# Altium project SCM.PrjPcb (part 1 of 2)
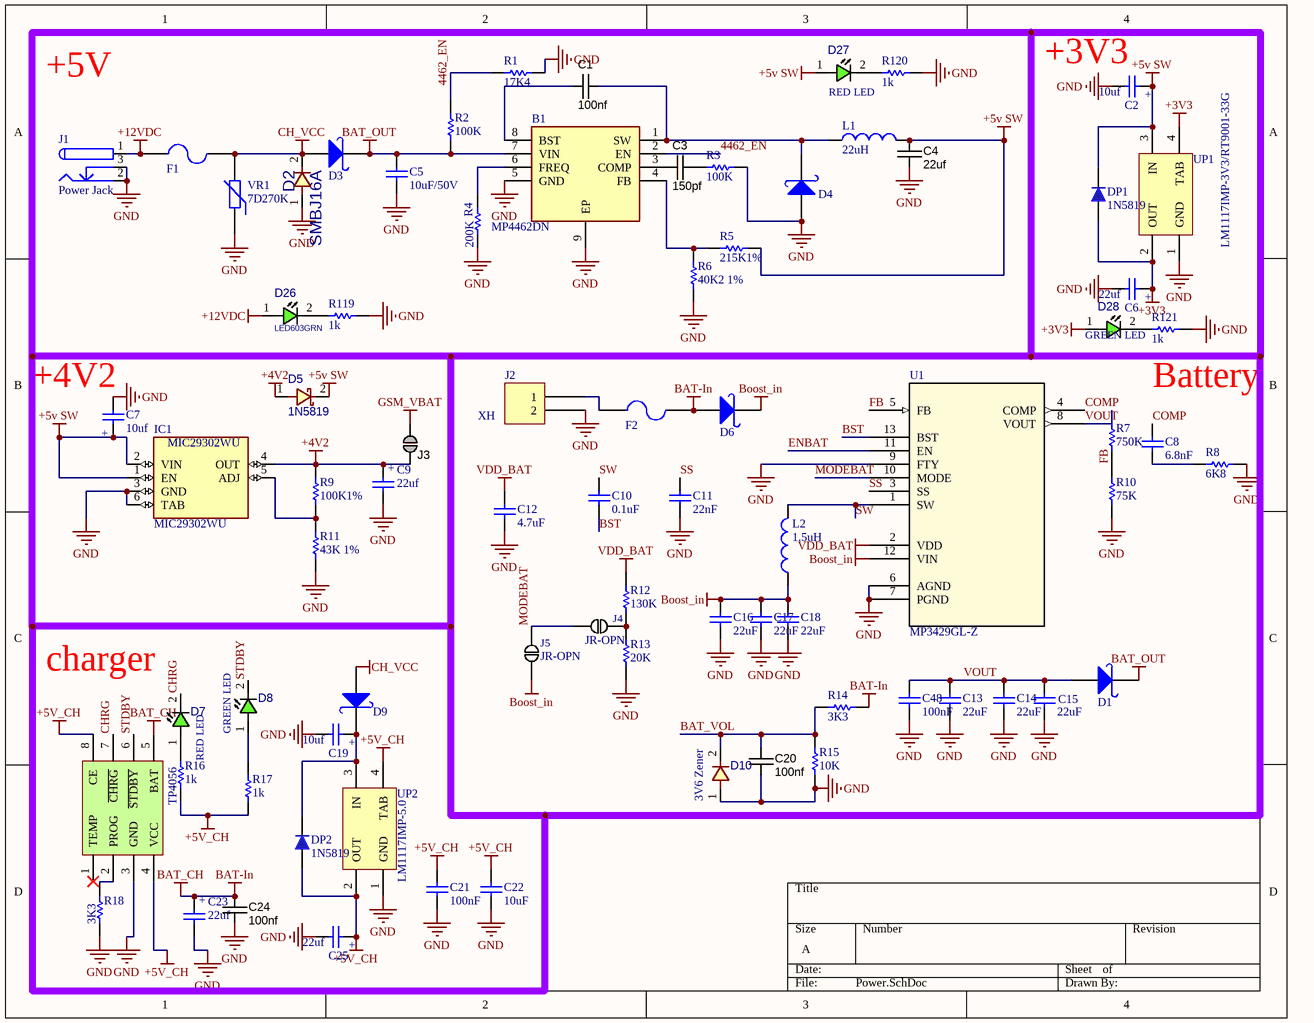
[diagram p0: Power.SchDoc]
10 sheets, 375 parts. Net scope: global (net labels, ports and power ports of the same name join across sheets).
Board files: PCB1.PcbDoc, POLY KEEP OUT.PcbDoc
Sheets:
  Power.SchDoc
  MCU.SchDoc
  UI.SchDoc
  GSM.SchDoc
  RF & wireless.SchDoc
  LAN.SchDoc
  sensors.SchDoc
  Outputs.SchDoc
  Power2.SchDoc
  memory.SchDoc

## Sheet Power.SchDoc
size A; SheetNumber: 1; SheetTotal: 10

### Parts
B1  MP4462DN  [SOIC127P600X170-9N]
C1  100nf  [CAPC1608X90N]
C2  10uf  [MY_CAP_SMD-A]
C3  150pf  [CAPC1608X90N]
C4  22uf  [CAPC1608X90N]
C5  10uF/50V
C6  22uf  [MY_CAP_SMD-A]
C7  10uf  [MY_CAP_SMD-A]
C8  6.8nF  [CAPC3413X12N]
C9  22uf  [MY_CAP_SMD-A]
C10  0.1uF  [CAPC3413X12N]
C11  22nF  [CAPC3413X12N]
C12  4.7uF  [CAPC3413X12N]
C13  22uF  [CAPC3413X12N]
C14  22uF  [CAPC3413X12N]
C15  22uF  [CAPC3413X12N]
C16  22uF  [CAPC3413X12N]
C17  22uF  [CAPC3413X12N]
C18  22uF  [CAPC3413X12N]
C19  10uf  [MY_CAP_SMD-A]
C20  100nf  [CAPC1608X90N]
C21  100nF  [CAPC3413X12N]
C22  10uF  [CAPC3413X12N]
C23  22uf  [MY_CAP_SMD-A]
C24  100nf  [CAPC1608X90N]
C25  22uf  [MY_CAP_SMD-A]
C48  100nF  [CAPC3413X12N]
D1  1n5822  [DO-214AB(SMC)]  (value not drawn)
D2  value SMBJ16A  [DO214AA SMB]  (hidden comment: SMBJ16A-TR)
D3  1n5822  [DO-214AB(SMC)]  (value not drawn)
D4  1n5822  [DO-214AB(SMC)]  (value not drawn)
D5  1N5819  [D_SOD123W]
D6  1n5822  [DO-214AB(SMC)]  (value not drawn)
D7  RED LED  [LED0603GRN]
D8  GREEN LED  [LED0603GRN]
D9  1n5822  [DO-214AB(SMC)]  (value not drawn)
D10  value 3V6 Zener  [D_SOD80]  (hidden comment: 5Z1)
D26  LED603GRN  [LED0603GRN]
D27  RED LED  [LED0603GRN]
D28  GREEN LED  [LED0603GRN]
DP1  1N5819  [430X270D]
DP2  1N5819  [430X270D]
F1  FUSE Socket  [Crystal SMD]  (value not drawn)
F2  FUSE Socket  (value not drawn)
IC1  MIC29302WU  [TO263-5]
J1  Power Jack  [Power Jack]
J2  XH  [JST XH B2B-XH-A]
J3  Jumper  [JUMP1]  (value not drawn)  (no BOM)
J4  JR-OPN
J5  JR-OPN
L1  22uH  [INDUCTOR_SMD_3A]
L2  1.5uH  [INDUCTOR_SMD_3A]
R1  17K4  [Resistor_SMD_0603 (1608)]
R2  100K  [Resistor_SMD_0603 (1608)]
R3  100K  [Resistor_SMD_0603 (1608)]
R4  200K  [Resistor_SMD_0603 (1608)]
R5  215K1%  [Resistor_SMD_0603 (1608)]
R6  40K2 1%  [Resistor_SMD_0603 (1608)]
R7  750K  [Resistor_SMD_0603 (1608)]
R8  6K8  [Resistor_SMD_0603 (1608)]
R9  100K1%  [Resistor_SMD_0603 (1608)]
R10  75K  [Resistor_SMD_0603 (1608)]
R11  43K 1%  [Resistor_SMD_0603 (1608)]
R12  130K  [Resistor_SMD_0603 (1608)]
R13  20K  [Resistor_SMD_0603 (1608)]
R14  3K3  [Resistor_SMD_0603 (1608)]
R15  10K  [Resistor_SMD_0603 (1608)]
R16  1k  [Resistor_SMD_0603 (1608)]
R17  1k  [Resistor_SMD_0603 (1608)]
R18  3K3  [Resistor_SMD_0603 (1608)]
R119  1k  [Resistor_SMD_0603 (1608)]
R120  1k  [Resistor_SMD_0603 (1608)]
R121  1k  [Resistor_SMD_0603 (1608)]
TP4056  TP4056  [TP4056]  (value not drawn)
U1  MP3429GL-Z  [QFN-3x4_MP3429_MNP]
UP1  LM1117IMP-3V3/RT9001-33G  [SOT223_M]
UP2  LM1117IMP-5.0  [SOT223_M]
VR1  7D270K  [05D XXX]

### Nets
+3V3: C6.+ D28.1(ANODE) DP1.1 UP1.2(OUT) UP1.4(TAB)
+4V2: C9.+ D5.1 IC1.4(OUT) J3.2 R9.2
+5v SW: C2.+ C4.2 C7.+ D5.2 D27.1(ANODE) DP1.2 IC1.1(EN) IC1.2(VIN) L1.2 R5.1 UP1.3(IN)
+5V_CH: C21.2 C22.2 C25.+ DP2.1 R16.1 R17.1 TP4056.4(VCC) TP4056.8(CE) UP2.2(OUT) UP2.4(TAB)
+12VDC: D26.1(ANODE) F1.1 J1.1
BAT-In: C23.+ C24.1 D6.1(A) F2.2 R14.2 TP4056.5(BAT)  [also labelled BAT_CH]
BAT_OUT: B1.7(VIN) C5.2 D1.2(K) D3.2(K) R2.1
Boost_in: C16.2 C17.2 C18.2 D6.2(K) J5.2 L2.1 U1.12(VIN)
CH_VCC: D2.2 D3.1(A) D9.1(A) F1.2 VR1.2
GND: B1.5(GND) B1.9(EP) C2.- C4.1 C5.1 C6.- C7.- C9.- C11.1 C12.1 C13.1 C14.1 C15.1 C16.1 C17.1 C18.1 C19.- C20.2 C21.1 C22.1 C23.- C24.2 C25.- C48.1 D2.1 D4.1(A) D10.1 IC1.3(GND) IC1.6(TAB) J1.2 J1.3 J2.2 R1.2 R3.1 R4.2 R6.1 R8.1 R10.1 R11.1 R13.1 R15.1 R18.1 R119.2 R120.2 R121.2 TP4056.3(GND) U1.6(AGND) U1.7(PGND) U1.9(FTY) UP1.1(GND) UP2.1(GND) VR1.1
GSM_VBAT: J3.1
VDD_BAT: C12.2 R12.2 U1.2(VDD)
4462_EN: B1.2(EN) R1.1 R2.2
BAT_VOL: C20.1 D10.2 R14.1 R15.2
BST: C10.1 U1.13(BST)
CHRG: D7.2(CATHODE) TP4056.7(~{CHRG})
COMP: C8.2 U1.4(COMP)
ENBAT: U1.11(EN)
FB: R7.1 R10.2 U1.5(FB)
MODEBAT: J4.2 J5.1 U1.10(MODE)
SS: C11.2 U1.3(SS)
STDBY: D8.2(CATHODE) TP4056.6(~{STDBY})
SW: C10.2 L2.2 U1.1(SW)
VOUT: C13.2 C14.2 C15.2 C48.2 D1.1(A) R7.2 U1.8(VOUT)
NetB1_1: B1.1(SW) C1.2 D4.2(K) L1.1
NetB1_3: B1.3(COMP) C3.1
NetB1_4: B1.4(FB) R5.2 R6.2
NetB1_6: B1.6(FREQ) R4.1
NetB1_8: B1.8(BST) C1.1
NetC3_2: C3.2 R3.2
NetC8_1: C8.1 R8.2
NetC19_+: C19.+ D9.2(K) DP2.2 UP2.3(IN)
NetD7_1: D7.1(ANODE) R16.2
NetD8_1: D8.1(ANODE) R17.2
NetD26_2: D26.2(CATHODE) R119.1
NetD27_2: D27.2(CATHODE) R120.1
NetD28_2: D28.2(CATHODE) R121.1
NetF2_1: F2.1 J2.1
NetIC1_5: IC1.5(ADJ) R9.1 R11.2
NetJ4_1: J4.1 R12.1 R13.2
NetR18_2: R18.2 TP4056.2(PROG)

Not connected (* = marked no-connect by the designer): TP4056 1(TEMP)*

### Notes on the sheet
- +5V
- (near C2) +3V3
- (near C7) +4V2
- Battery
- (near D7) charger

### Library data of the parts
B1 = MP4462DN-Z-LF: Power Supply; Manufacturer_Name: Monolithic Power Systems (MPS); Geometry.Height: 1.7mm; Manufacturer_Part_Number: MP4462DN-Z-LF; Mouser Part Number: *; Mouser Price/Stock: *; Arrow Part Number: *; Arrow Price/Stock: *; Datasheet Link: https://datasheet.octopart.com/MP4462DN-LF-Z-Monolithic-Power-Systems-datasheet-26450847.pdf
C1 C3 = CAPC_100n_0603_X7R_50V_10%: Capacitor C SMD 0603; Manufacturer 1: AVX Corporation; Manufacturer Part Number 1: 06035C104KAT2A; Tolerance: ±10%; Ratings: 50V; X7R; Material: ceramic; SCDType: spec; Value: 100n; Manufacturer 2: TDK Corporation; Manufacturer Part Number 2: C1608X7R1H104K; Package / Case: 0603 (1608 Metric); Supplier 1: Digi-Key; Supplier Part Number 1: 478-5052-1-ND; ComponentLink1URL: http://www.avx.com/docs/Catalogs/cx7r.pdf; ComponentLink1Description: http://www.avx.com/docs/Catalogs/cx7r.pdf; Supplier 2: Digi-Key; Supplier Part Number 2: 445-1314-1-ND; ComponentLink2URL: http://product.tdk.com/capacitor/mlcc/en/documents/mlcc_commercial_general_en.pdf; ComponentLink2Description: http://product.tdk.com/capacitor/mlcc/en/documents/mlcc_commercial_general_en.pdf
C2 C6 C7 C9 C23 = CAP_TANTAL_A: Capacitor Tantalum SMD; Value: 3300u
C4 = CAPC_100n_0603_X7R_50V_10%: Capacitor C SMD 1206; Manufacturer 1: AVX Corporation; Manufacturer Part Number 1: 06035C104KAT2A; Tolerance: ±10%; Ratings: 50V; X7R; Material: ceramic; SCDType: spec; Value: 100n; Manufacturer 2: TDK Corporation; Manufacturer Part Number 2: C1608X7R1H104K; Package / Case: 0603 (1608 Metric); Supplier 1: Digi-Key; Supplier Part Number 1: 478-5052-1-ND; ComponentLink1URL: http://www.avx.com/docs/Catalogs/cx7r.pdf; ComponentLink1Description: http://www.avx.com/docs/Catalogs/cx7r.pdf; Supplier 2: Digi-Key; Supplier Part Number 2: 445-1314-1-ND; ComponentLink2URL: http://product.tdk.com/capacitor/mlcc/en/documents/mlcc_commercial_general_en.pdf; ComponentLink2Description: http://product.tdk.com/capacitor/mlcc/en/documents/mlcc_commercial_general_en.pdf
C5 = CAP SMD 0805: Capacitor C SMD 1206
C8 = CAP SMD 0805: Capacitor C SMD 0603; Designer: Abbas Basereh; Desc.: CAP SMD 0805; Data: 16-12-2016
C10-C15 C18 C21 C22 C48 = CAP SMD 0805: CAP 0805; Designer: Abbas Basereh; Desc.: CAP SMD 0805; Data: 16-12-2016
C16 C17 = CAP SMD 0805: Capacitor C SMD 0805; Designer: Abbas Basereh; Desc.: CAP SMD 0805; Data: 16-12-2016
C19 C25 = CAP_TANTAL_A: 3.2X1.6MM; Value: 3300u
C20 C24 = CAPC_100n_0603_X7R_50V_10%: Capacitor SMD Cer 100nF 10% 50V X7R 0603; Manufacturer 1: AVX Corporation; Manufacturer Part Number 1: 06035C104KAT2A; Ratings: 50V; X7R; Material: ceramic; SCDType: spec; Value: 100n; Manufacturer 2: TDK Corporation; Manufacturer Part Number 2: C1608X7R1H104K; Package / Case: 0603 (1608 Metric); Tolerance: ±10%; Supplier 1: Digi-Key; Supplier Part Number 1: 478-5052-1-ND; ComponentLink1URL: http://www.avx.com/docs/Catalogs/cx7r.pdf; ComponentLink1Description: http://www.avx.com/docs/Catalogs/cx7r.pdf; Supplier 2: Digi-Key; Supplier Part Number 2: 445-1314-1-ND; ComponentLink2URL: http://product.tdk.com/capacitor/mlcc/en/documents/mlcc_commercial_general_en.pdf; ComponentLink2Description: http://product.tdk.com/capacitor/mlcc/en/documents/mlcc_commercial_general_en.pdf
D1 D3 D4 D6 D9 = 1n5822 SMD: Schottky Rectifiers; Part. No: SS34; Manufacturer: ON Semiconductor/Fairchild; Designer: Abbas Basereh; Link: https://www.aliexpress.com/item/Free-shipping-100pcs-1n5822-sma-smd-do-214ac-Schottky-diode-ss34/32337482329.html?spm=2114.01010208.3.1.zLZDsP&ws_ab_test=searchweb0_0,searchweb201602_4_10065_10068_10084_10083_10080_10082_10081_10060_10061_10062_10056_10055_10054_10059_10099_10078_10079_427_10073_10103_10102_10096_10052_10050_10051,searchweb201603_4&btsid=6e50dc92-ac69-45bc-a19e-209af19ce602; Link: http://www.tme.eu/en/details/ss34/smd-schottky-diodes/vishay/ss34-e357t/; Link: http://www.digikey.com/product-detail/en/on-semiconductor-fairchild/SS34/SS34FSCT-ND/2094459; Data: 16-12-2016
D2 = SMBJ12A-TR: TVS Surface Mount Transient Voltage Suppressors Diode
D5 = DIODE_SMD_SCHOTTKY_1N5819: DIODE, GENERAL PURPOSE, 1000V/1A; MANF: DIODES; MANF_P#: 1N5819HW-7-F; DESC: DESCRIPTION; PARAM2: 1A; PARAM: 40V; ASSEMBLY: ASSEMBLY; PRICE: PRICE; VALUE: 1N5819
D7 D8 D27 D28 = LED_SMD_0603_GRN: LED, SMD, 0603, GREEN; PARAM: 20mA; MANF: Kingbright; DESC: DESCRIPTION; MANF_P#: APT1608SGC; PARAM2: 2.2V; VALUE: LED603GRN; ASSEMBLY: ASSEMBLY; PRICE: 1: 0.14$, 100: 6.8$
D10 = 1N4148 SMD: DIODE, FAST SWTICHING, 0.3A, 0.5W
D26 = LED_SMD_0603_GRN: LED, SMD, 0603, GREEN; PARAM: 20mA; MANF: Kingbright; DESC: DESCRIPTION; MANF_P#: APT1608SGC; PARAM2: 2.2V; ASSEMBLY: ASSEMBLY; PRICE: 1: 0.14$, 100: 6.8$; VALUE: LED603GRN
DP1 = 1N5819: DIODE, GENERAL PURPOSE, 1000V/1A; Designer: Abbas Basereh; Data: 16-12-2016; Link: *; Part. No: *
DP2 = 1N5819: Schottkey Rectifiers; Designer: Abbas Basereh; Data: 16-12-2016; Link: *; Part. No: *
F1 F2 = Fuse SMD1206: SMD Fuses 1808; Designer: Abbas Basereh; Desc.: SMD Fuses 1206; Data: 16-12-2016
IC1 = MIC29302WU: Linear Voltage Regulator IC 1 Output 3A TO-263-5; MF: {'manufacturer': u'Microchip Technology'}; Package: None; Price: None; Value: *; MP: MIC29302WU; Availability: Unavailable
J2 = B2B-XH-A(LF)(SN): CONN HEADER VERT 2POS 2.5MM XH; Manufacturer: JST Sales America Inc.; Contact Length - Post: 0.134" (3.40mm); Current Rating (Amps): 3A; Material Flammability Rating: UL94 V-0; Number of Positions: 2; Number of Positions Loaded: All; Pitch - Mating: 0.098" (2.50mm); Shrouding: Shrouded - 4 Wall; Style: Board to Cable/Wire; Voltage Rating: 250V; Part Number: B2B-XH-A(LF)(SN); ComponentLink1Description: Datasheet; ComponentLink1URL: http://www.jst-mfg.com/product/pdf/eng/eXH.pdf; ComponentLink2Description: DigiKey Link; ComponentLink2URL: http://digikey.com/product-detail/en/jst-sales-america-inc/B2B-XH-A-LF-SN/455-2247-ND/1651045; Connector Type: Header; Contact Finish - Mating: Tin; Contact Finish - Post: Tin; Contact Material: Brass; Contact Shape: Square; Contact Type: Male Pin; Fastening Type: Detent Lock; Insulation Color: Natural; Insulation Height: 0.276" (7.00mm); Insulation Material: Polyamide (PA66), Nylon 6/6; LastUpdated: 1/12/2020 11:46:08 PM; Lifecycle Status: Active; Minimum Order: 1; Mounting Type: Through Hole; Number of Rows: 1; Operating Temperature: -25°C ~ 85°C; Packaging: Bulk; PartId: 67; Part Status: Active; Price: 0.15; Series: XH; Supplier 1: DigiKey; Supplier Part Number 1: 455-2247-ND; Termination: Press-Fit, Solder
J3 = JUMP1: SMD jumper
J4 J5 = BYPASS: SOLDERDOT BYPASS; Manufacturer Part Number 1: Board Feature; Reel: Open; Supplier 1: Solder-it-yourself; Manufacturer 1: Board feature
L1 L2 = INDUCTOR_SMD_3A
R1 R5 = Resistor: Resistor SMD 0805; Email: razi.vesali@gmail.com; Value: 10k; Published: 17-Jun-2016; LatestRevisionNote: Re-released for puplic; Publisher: Seyed Razi Vesali
R2-R4 R6 = Resistor: Resistor SMD 0603; Email: razi.vesali@gmail.com; Value: 10k; Published: 17-Jun-2016; LatestRevisionNote: Re-released for puplic; Publisher: Seyed Razi Vesali
R7-R11 R13 R14 R17 R18 R120 R121 = Resistor: Resistor 0603; Email: razi.vesali@gmail.com; Value: 10k; Published: 17-Jun-2016; LatestRevisionNote: Re-released for puplic; Publisher: Seyed Razi Vesali
R12 R16 = Resistor: Resistor0603; Email: razi.vesali@gmail.com; Value: 10k; Published: 17-Jun-2016; LatestRevisionNote: Re-released for puplic; Publisher: Seyed Razi Vesali
R15 = Resistor: Resistor 0603; Email: razi.vesali@gmail.com; Published: 17-Jun-2016; LatestRevisionNote: Re-released for puplic; Publisher: Seyed Razi Vesali; Value: 10k
R119 = Resistor: Email: razi.vesali@gmail.com; Value: 10k; Published: 17-Jun-2016; LatestRevisionNote: Re-released for puplic; Publisher: Seyed Razi Vesali
U1 = MP3429GL-Z: No Description Available; Mfr_Name: Monolithic Power Systems; Copyright: Copyright (C) 2022 Ultra Librarian. All rights reserved.; Manufacturer_Part_Number: MP3429GL-Z; RefDes: RefDes; Type: DEV
UP1 UP2 = AMS1117-x.x: x.x Volt, 800mA Low-Dropout Linear Regulator, 4-pin SOT-223; Designer: Ali Hafizi; Data: 16-12-2016
VR1 = VARISTOR (VDR): VARISTORS; Manufacturer: china-canada-philipina; Designer: Abbas Basereh; VALUE: xxDxxx; Models: MOV-VDR-COV; Data: 2017-1-5; Link: digikey.com; PUBLISHER: ABBAS BASEREH

## Sheet MCU.SchDoc
size A; SheetNumber: 2; SheetTotal: 10
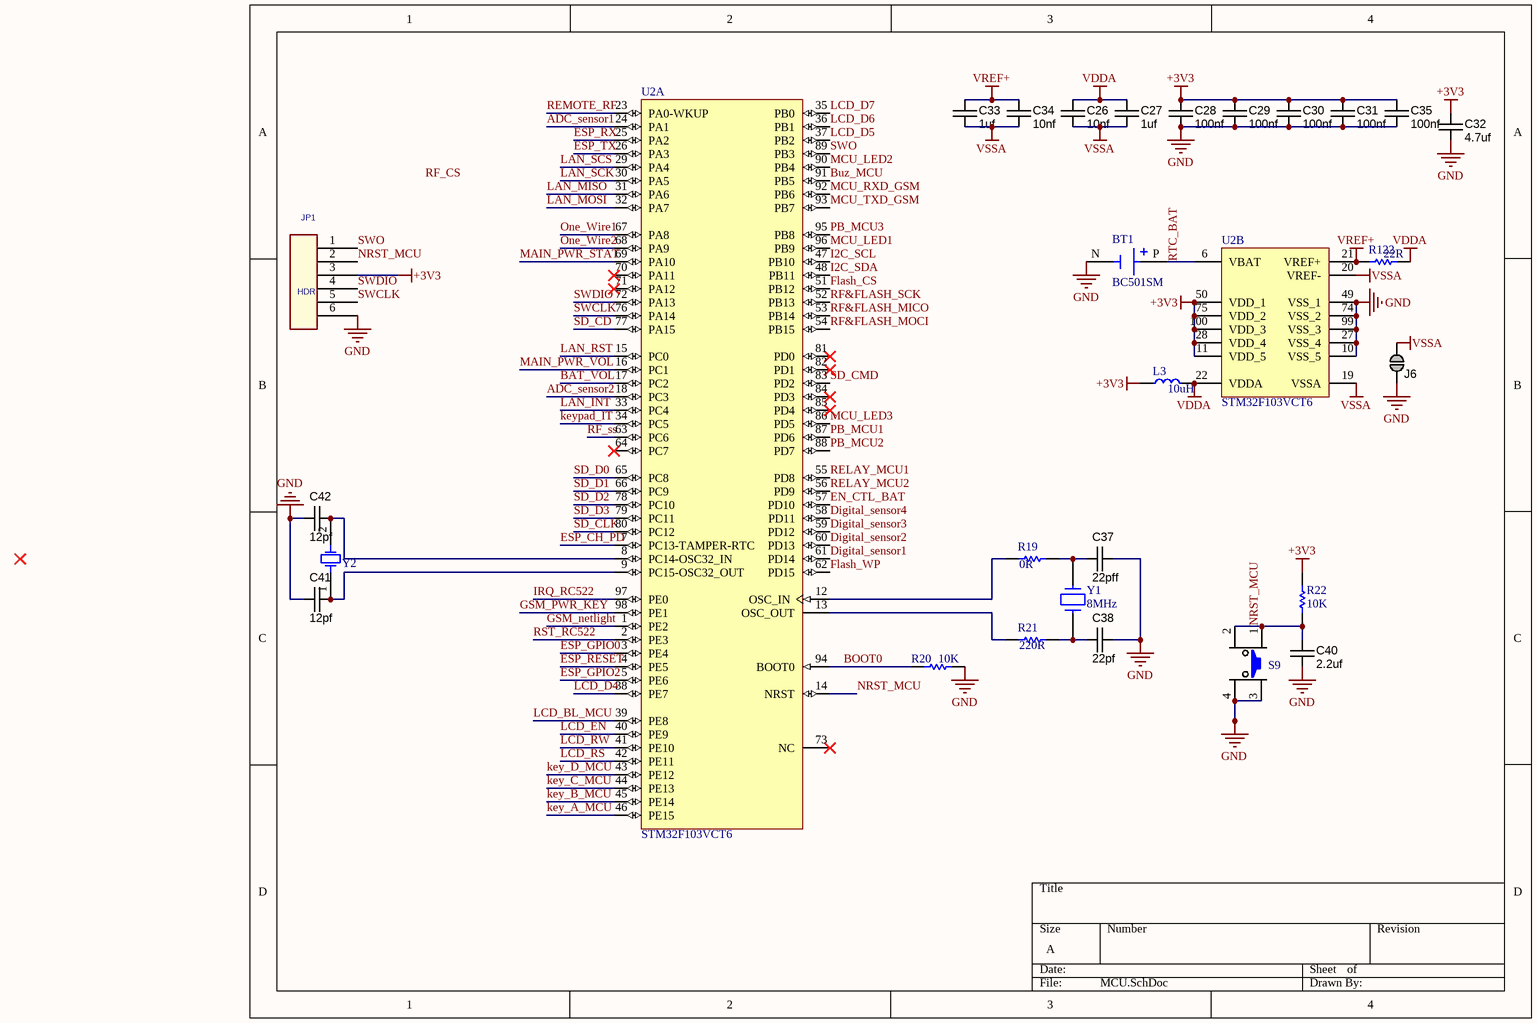
[diagram p1: MCU.SchDoc]

### Parts
BT1  BC501SM  [BAT_BC501SM]
C26  10nf  [CAPC1608X90N]
C27  1uf  [CAPC1608X90N]
C28  100nf  [CAPC1608X90N]
C29  100nf  [CAPC1608X90N]
C30  100nf  [CAPC1608X90N]
C31  100nf  [CAPC1608X90N]
C32  4.7uf  [CAPC1608X90N]
C33  1uf  [CAPC1608X90N]
C34  10nf  [CAPC1608X90N]
C35  100nf  [CAPC1608X90N]
C37  22pff  [CAPC1608X90N]
C38  22pf  [CAPC1608X90N]
C40  2.2uf  [CAPC1608X90N]
C41  12pf  [CAPC1608X90N]
C42  12pf  [CAPC1608X90N]
J6  Jumper  [JUMP1]  (value not drawn)  (no BOM)
JP1  HDR  [HDR_1x6]
L3  10uH  [L0805]
R19  0R  [Resistor_SMD_0603 (1608)]
R20  10K  [Resistor_SMD_0603 (1608)]
R21  220R  [Resistor_SMD_0603 (1608)]
R22  10K  [Resistor_SMD_0603 (1608)]
R122  22R  [Resistor_SMD_0603 (1608)]
S9  SW_PB4 SMD  [SMD_PB]  (value not drawn)
U2  STM32F103VCT6  [STM-LQFP100_L]  (parts A,B of 2)
Y1  8MHz  [My_Crystal - SMD]
Y2  32.768KHz  [Crystal Clock RIGHT 3]  (value not drawn)

### Nets
+3V3: C28.2 C29.2 C30.2 C31.2 C32.2 C35.2 JP1.3 L3.1 R22.1 U2.11(VDD_5) U2.28(VDD_4) U2.50(VDD_1) U2.75(VDD_2) U2.100(VDD_3)
GND: BT1.N(NEG) C28.1 C29.1 C30.1 C31.1 C32.1 C35.1 C37.2 C38.2 C40.2 C41.2 C42.2 J6.1 JP1.6 R20.2 S9.3 S9.4 U2.10(VSS_5) U2.27(VSS_4) U2.49(VSS_1) U2.74(VSS_2) U2.99(VSS_3)
VDDA: C26.2 C27.2 L3.2 R122.1 U2.22(VDDA)
VREF+: C33.2 C34.2 R122.2 U2.21(VREF+)
VSSA: C26.1 C27.1 C33.1 C34.1 J6.2 U2.19(VSSA) U2.20(VREF-)
ADC_sensor1: U2.24(PA1)
ADC_sensor2: U2.18(PC3)
BAT_VOL: U2.17(PC2)
BOOT0: R20.1 U2.94(BOOT0)
Buz_MCU: U2.91(PB5)
Digital_sensor1: U2.61(PD14)
Digital_sensor2: U2.60(PD13)
Digital_sensor3: U2.59(PD12)
Digital_sensor4: U2.58(PD11)
EN_CTL_BAT: U2.57(PD10)
ESP_CH_PD: U2.7(PC13-TAMPER-RTC)
ESP_GPIO0: U2.3(PE4)
ESP_GPIO2: U2.5(PE6)
ESP_RESET: U2.4(PE5)
ESP_RX: U2.25(PA2)
ESP_TX: U2.26(PA3)
Flash_CS: U2.51(PB12)
Flash_WP: U2.62(PD15)
GSM_netlight: U2.1(PE2)
GSM_PWR_KEY: U2.98(PE1)
I2C_SCL: U2.47(PB10)
I2C_SDA: U2.48(PB11)
IRQ_RC522: U2.97(PE0)
key_A_MCU: U2.46(PE15)
key_B_MCU: U2.45(PE14)
key_C_MCU: U2.44(PE13)
key_D_MCU: U2.43(PE12)
keypad_IT: U2.34(PC5)
LAN_INT: U2.33(PC4)
LAN_MISO: U2.31(PA6)
LAN_MOSI: U2.32(PA7)
LAN_RST: U2.15(PC0)
LAN_SCK: U2.30(PA5)
LAN_SCS: U2.29(PA4)
LCD_BL_MCU: U2.39(PE8)
LCD_D4: U2.38(PE7)
LCD_D5: U2.37(PB2)
LCD_D6: U2.36(PB1)
LCD_D7: U2.35(PB0)
LCD_EN: U2.40(PE9)
LCD_RS: U2.42(PE11)
LCD_RW: U2.41(PE10)
MAIN_PWR_STAT: U2.69(PA10)
MAIN_PWR_VOL: U2.16(PC1)
MCU_LED1: U2.96(PB9)
MCU_LED2: U2.90(PB4)
MCU_LED3: U2.86(PD5)
MCU_RXD_GSM: U2.92(PB6)
MCU_TXD_GSM: U2.93(PB7)
NRST_MCU: C40.1 JP1.2 R22.2 S9.1 S9.2 U2.14(NRST)
One_Wire1: U2.67(PA8)
One_Wire2: U2.68(PA9)
PB_MCU1: U2.87(PD6)
PB_MCU2: U2.88(PD7)
PB_MCU3: U2.95(PB8)
RELAY_MCU1: U2.55(PD8)
RELAY_MCU2: U2.56(PD9)
REMOTE_RF: U2.23(PA0-WKUP)
RF&FLASH_MICO: U2.53(PB14)
RF&FLASH_MOCI: U2.54(PB15)
RF&FLASH_SCK: U2.52(PB13)
RF_ss: U2.63(PC6)
RST_RC522: U2.2(PE3)
RTC_BAT: BT1.P(POS) U2.6(VBAT)
SD_CD: U2.77(PA15)
SD_CLK: U2.80(PC12)
SD_CMD: U2.83(PD2)
SD_D0: U2.65(PC8)
SD_D1: U2.66(PC9)
SD_D2: U2.78(PC10)
SD_D3: U2.79(PC11)
SWCLK: JP1.5 U2.76(PA14)
SWDIO: JP1.4 U2.72(PA13)
SWO: JP1.1 U2.89(PB3)
NetC37_1: C37.1 R19.2 Y1.2
NetC38_1: C38.1 R21.2 Y1.1
NetC41_1: C41.1 U2.9(PC15-OSC32_OUT) Y2.1
NetC42_1: C42.1 U2.8(PC14-OSC32_IN) Y2.2
NetR19_1: R19.1 U2.12(OSC_IN)
NetR21_1: R21.1 U2.13(OSC_OUT)

Not connected (* = marked no-connect by the designer): U2 64(PC7)* 70(PA11)* 71(PA12)* 73(NC)* 81(PD0)* 82(PD1)* 84(PD3)* 85(PD4)*

### Notes on the sheet
- Labels drawn without touching a wire or pin: RF_CS

### Library data of the parts
BT1 = BC501SM: BATTERY HOLDER COIN 12MM SMD; MF: MPD; SnapEDA_Link: https://www.snapeda.com/parts/BC501SM/MPD/view-part/?ref=snap; Package: None; MP: BC501SM; Price: None; Availability: Unavailable; Check_prices: https://www.snapeda.com/parts/BC501SM/MPD/view-part/?ref=eda; Value: *
C26-C35 C37 C38 C40-C42 = CAPC_100n_0603_X7R_50V_10%: as C20 on sheet Power; Manufacturer 2: TDK Corporation; Manufacturer Part Number 2: C1608X7R1H104K; Package / Case: 0603 (1608 Metric); Tolerance: ±10%; Supplier 1: Digi-Key; Supplier Part Number 1: 478-5052-1-ND; ComponentLink1URL: http://www.avx.com/docs/Catalogs/cx7r.pdf; ComponentLink1Description: http://www.avx.com/docs/Catalogs/cx7r.pdf; Supplier 2: Digi-Key; Supplier Part Number 2: 445-1314-1-ND; ComponentLink2URL: http://product.tdk.com/capacitor/mlcc/en/documents/mlcc_commercial_general_en.pdf; ComponentLink2Description: http://product.tdk.com/capacitor/mlcc/en/documents/mlcc_commercial_general_en.pdf
J6 = JUMP1: SMD jumper
JP1 = Header 1x6: header or jumper box; DESIGNER: ABBAS BASEREH
L3 = Inductor SMD NC 0805: Value: 1uH; DatasheetVersion: 2022; ComponentLink1Description: Tarahiboard; ComponentLink1URL: https://www.tarahiboard.com/product/library-pack
R19 R21 R122 = Resistor: as R7 on sheet Power; Published: 17-Jun-2016; LatestRevisionNote: Re-released for puplic; Publisher: Seyed Razi Vesali
R20 R22 = Resistor: as R15 on sheet Power; Published: 17-Jun-2016; LatestRevisionNote: Re-released for puplic; Publisher: Seyed Razi Vesali; Value: 10k
U2 = STM32F103VCT6: ARM Cortex-M3 32-bit MCU, 256 KB Flash, 48 KB Internal RAM, 80 I/Os, 100-pin LQFP, -40 to 85 degC, Tray; ComponentLink1Description: Website: Tarahiboard; ComponentLink1URL: https://www.tarahiboard.com
Y1 = CRYSTAL_SMD: Crystal
Y2 = Crystal RTC: Crystal; ComponentLink1Description: Website: Tarahiboard; ComponentLink1URL: https://www.tarahiboard.com/product/library-pack; DatasheetVersion: 2022
S9 = SW_PB4 SMD: ComponentLink1Description: Website Smart World; ComponentLink1URL: https://www.smartw.ir/; ComponentLink2Description: Telegram; ComponentLink2URL: https://t.me/altium_smartw; ComponentLink3Description: Instagram; ComponentLink3URL: https://Instagram.com/smartgw.ir; DatasheetVersion: 2021

## Sheet UI.SchDoc
size A; SheetNumber: 3; SheetTotal: 10
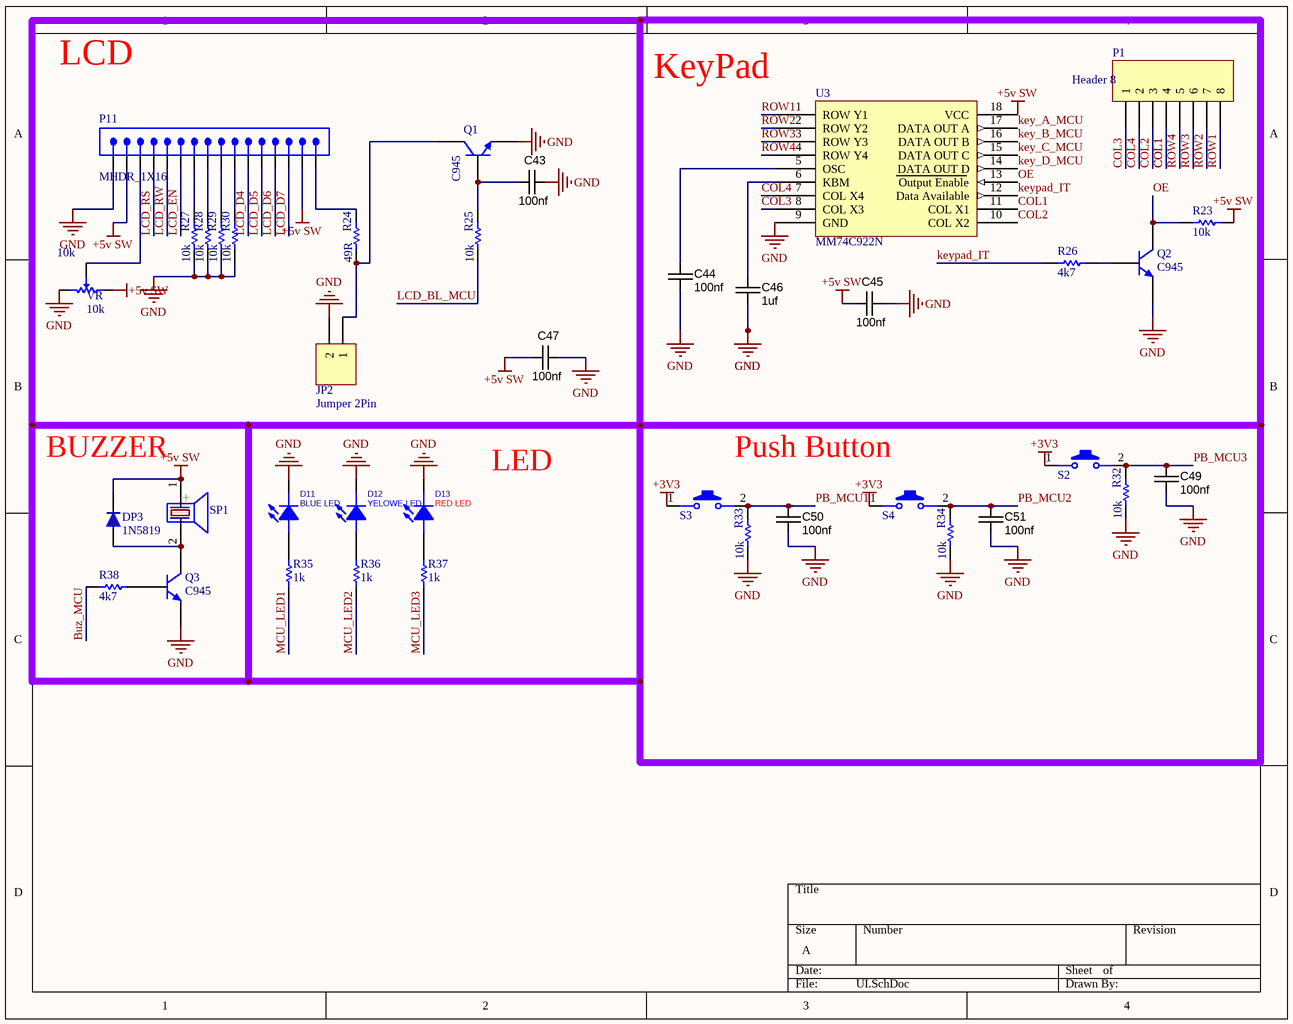
[diagram p2: UI.SchDoc]

### Parts
C43  100nf  [CAPC1608X90N]
C44  100nf  [CAPC1608X90N]
C45  100nf  [CAPC1608X90N]
C46  1uf  [CAPC1608X90N]
C47  100nf  [CAPC1608X90N]
C49  100nf  [CAPC1608X90N]
C50  100nf  [CAPC1608X90N]
C51  100nf  [CAPC1608X90N]
D11  BLUE LED  [LED5MM_BLUE]
D12  YELOWE LED  [LED5MM_YELLOW]
D13  RED LED  [LED5MM_RED]
DP3  1N5819  [430X270D]
JP2  Jumper 2Pin  [Jumper Small - 2.54 - Blue]
P1  Header 8  [HDR1X8]
P11  MHDR_1X16  [MHDR1X16-254P]
Q1  C945  [SOT23_N]
Q2  C945  [SOT23_N]
Q3  C945  [SOT23_N]
R23  10k  [Resistor_SMD_0603 (1608)]
R24  49R  [Resistor_SMD_0603 (1608)]
R25  10k  [Resistor_SMD_0603 (1608)]
R26  4k7  [Resistor_SMD_0603 (1608)]
R27  10k  [Resistor_SMD_0603 (1608)]
R28  10k  [Resistor_SMD_0603 (1608)]
R29  10k  [Resistor_SMD_0603 (1608)]
R30  10k  [Resistor_SMD_0603 (1608)]
R32  10k  [Resistor_SMD_0603 (1608)]
R33  10k  [Resistor_SMD_0603 (1608)]
R34  10k  [Resistor_SMD_0603 (1608)]
R35  1k  [Resistor_SMD_0603 (1608)]
R36  1k  [Resistor_SMD_0603 (1608)]
R37  1k  [Resistor_SMD_0603 (1608)]
R38  4k7  [Resistor_SMD_0603 (1608)]
S2  SW_PB2  [THT_ALPS_SKQKAJD010]  (value not drawn)
S3  SW_PB2  [THT_ALPS_SKQKAJD010]  (value not drawn)
S4  SW_PB2  [THT_ALPS_SKQKAJD010]  (value not drawn)
SP1  (no value)  [BUZZER 7.62mm DC]
U3  MM74C922N  [DIP18]
VR  10k  [Multi Turn]

### Nets
+3V3: S2.1(Button) S3.1(Button) S4.1(Button)
+5v SW: C45.1 C47.1 DP3.2 P11.2 P11.15 R23.1 SP1.1(+) U3.18(VCC) VR.1(CCW)
GND: C43.2 C44.2 C45.2 C46.2 C47.2 C49.1 C50.1 C51.1 D11.2(CATHODE) D12.2(CATHODE) D13.2(CATHODE) JP2.2 P11.1 Q1.2(E) Q2.2(E) Q3.2(E) R27.2 R28.2 R29.2 R30.2 R32.2 R33.2 R34.2 U3.9(GND) VR.2(CW)
Buz_MCU: R38.1
COL1: P1.4 U3.11(COL_X1)
COL2: P1.3 U3.10(COL_X2)
COL3: P1.1 U3.8(COL_X3)
COL4: P1.2 U3.7(COL_X4)
key_A_MCU: U3.17(DATA_OUT_A)
key_B_MCU: U3.16(DATA_OUT_B)
key_C_MCU: U3.15(DATA_OUT_C)
key_D_MCU: U3.14(DATA_OUT_D)
keypad_IT: R26.1 U3.12(Data_Available)
LCD_BL_MCU: R25.2
LCD_D4: P11.11
LCD_D5: P11.12
LCD_D6: P11.13
LCD_D7: P11.14
LCD_EN: P11.6
LCD_RS: P11.4
LCD_RW: P11.5
MCU_LED1: R35.1
MCU_LED2: R36.1
MCU_LED3: R37.1
OE: Q2.3(C) R23.2 U3.13(Output_Enable)
PB_MCU1: C50.2 R33.1 S3.2
PB_MCU2: C51.2 R34.1 S4.2
PB_MCU3: C49.2 R32.1 S2.2
ROW1: P1.8 U3.1(ROW_Y1)
ROW2: P1.7 U3.2(ROW_Y2)
ROW3: P1.6 U3.3(ROW_Y3)
ROW4: P1.5 U3.4(ROW_Y4)
NetC43_1: C43.1 Q1.1(B) R25.1
NetC44_1: C44.1 U3.5(OSC)
NetC46_1: C46.1 U3.6(KBM)
NetD11_1: D11.1(ANODE) R35.2
NetD12_1: D12.1(ANODE) R36.2
NetD13_1: D13.1(ANODE) R37.2
NetDP3_1: DP3.1 Q3.3(C) SP1.2(-)
NetJP2_1: JP2.1 Q1.3(C) R24.2
NetP11_3: P11.3 VR.3(Setpoint)
NetP11_7: P11.7 R27.1
NetP11_8: P11.8 R28.1
NetP11_9: P11.9 R29.1
NetP11_10: P11.10 R30.1
NetP11_16: P11.16 R24.1
NetQ2_1: Q2.1(B) R26.2
NetQ3_1: Q3.1(B) R38.2

### Notes on the sheet
- LCD
- KeyPad
- BUZZER
- LED
- Push Button

### Library data of the parts
C43-C47 C49-C51 = CAPC_100n_0603_X7R_50V_10%: as C20 on sheet Power; Manufacturer 2: TDK Corporation; Manufacturer Part Number 2: C1608X7R1H104K; Package / Case: 0603 (1608 Metric); Tolerance: ±10%; Supplier 1: Digi-Key; Supplier Part Number 1: 478-5052-1-ND; ComponentLink1URL: http://www.avx.com/docs/Catalogs/cx7r.pdf; ComponentLink1Description: http://www.avx.com/docs/Catalogs/cx7r.pdf; Supplier 2: Digi-Key; Supplier Part Number 2: 445-1314-1-ND; ComponentLink2URL: http://product.tdk.com/capacitor/mlcc/en/documents/mlcc_commercial_general_en.pdf; ComponentLink2Description: http://product.tdk.com/capacitor/mlcc/en/documents/mlcc_commercial_general_en.pdf
D11-D13 = LED5MM: LED LIGHTING; Designer: Abbas Basereh; Data: 16-12-2016; Link: *; Part.No: *
DP3 = 1N5819: as DP2 on sheet Power; Data: 16-12-2016; Link: *; Part. No: *
JP2 = Jumper 2Pin: Jumper, 2-Pin; Designer: Abbas Basereh; Data: 16-12-2016; Link: *
P1 = Header 8: Header, 8-Pin; LatestRevisionDate: 17-Jul-2002; LatestRevisionNote: Re-released for DXP Platform.; Publisher: Altium Limited
P11 = MHDR_1X16: Male Header 1X16
Q1-Q3 = C945: NPN Silicon Epitaxial Planar Transistor; Published: 2017-2-8; LatestRevisionDate: 2017; LatestRevisionNote: IPC-7351 Footprint Added.; DatasheetVersion: 2017; PackageVersion: 2017-2-8; PackageReference: SOT23; Publisher: Abbas Basereh; PackageDescription: 3-Pin SOT-23 Package 0.95 mm Pitch, 2.3 mm Lead Span; ComponentLink1Description: Manufacturer Link; ComponentLink1URL: http://www.taitroncomponents.com/; ComponentLink2Description: Datasheet; ComponentLink2URL: http://www.taitroncomponents.com/
R23 R25 R27-R30 R32-R34 = Resistor: as R15 on sheet Power; Published: 17-Jun-2016; LatestRevisionNote: Re-released for puplic; Publisher: Seyed Razi Vesali; Value: 10k
R24 R26 R35-R38 = Resistor: as R7 on sheet Power; Published: 17-Jun-2016; LatestRevisionNote: Re-released for puplic; Publisher: Seyed Razi Vesali
S2-S4 = SW_PB2: 2 Pin Push Button Switch; Company: SJ Libraries; Designer: Eng. Saeid Jorablo; Mounting Technology: Surface Mount\Through-Hole; ComponentLink1Description: Datasheet; Pin Count: 0; Update Date: 6/3/2012; Category: MISC; HelpURL: http://s3.picofile.com/file/7443264187/Coming_Soon_logo.gif
SP1 = PIEZO BUZZER: PIEZO BUZZER ACTIVE; Designer: Abbas Basereh; Comment_1: SPEAKER AND BEEP; Design Date: 1395/11/14; ComponentLink2Description: Reference; PackageDescription: THD; Publisher: Abbas Basereh; Mounting Technology: THD; Pin Count: 2; Status: Unreleased
U3 = MM74c922N_Fairchild: 16-Key Encoder
VR = Multi Turn: Email: Razi.vesali@gmail.com; LatestRevisionDate: 17-Jul-2016; LatestRevisionNote: Re-released for Puplic; Publisher: Seyed Razi vesali (SRV); Value: 10k

## Sheet GSM.SchDoc
size A; SheetNumber: 4; SheetTotal: 10
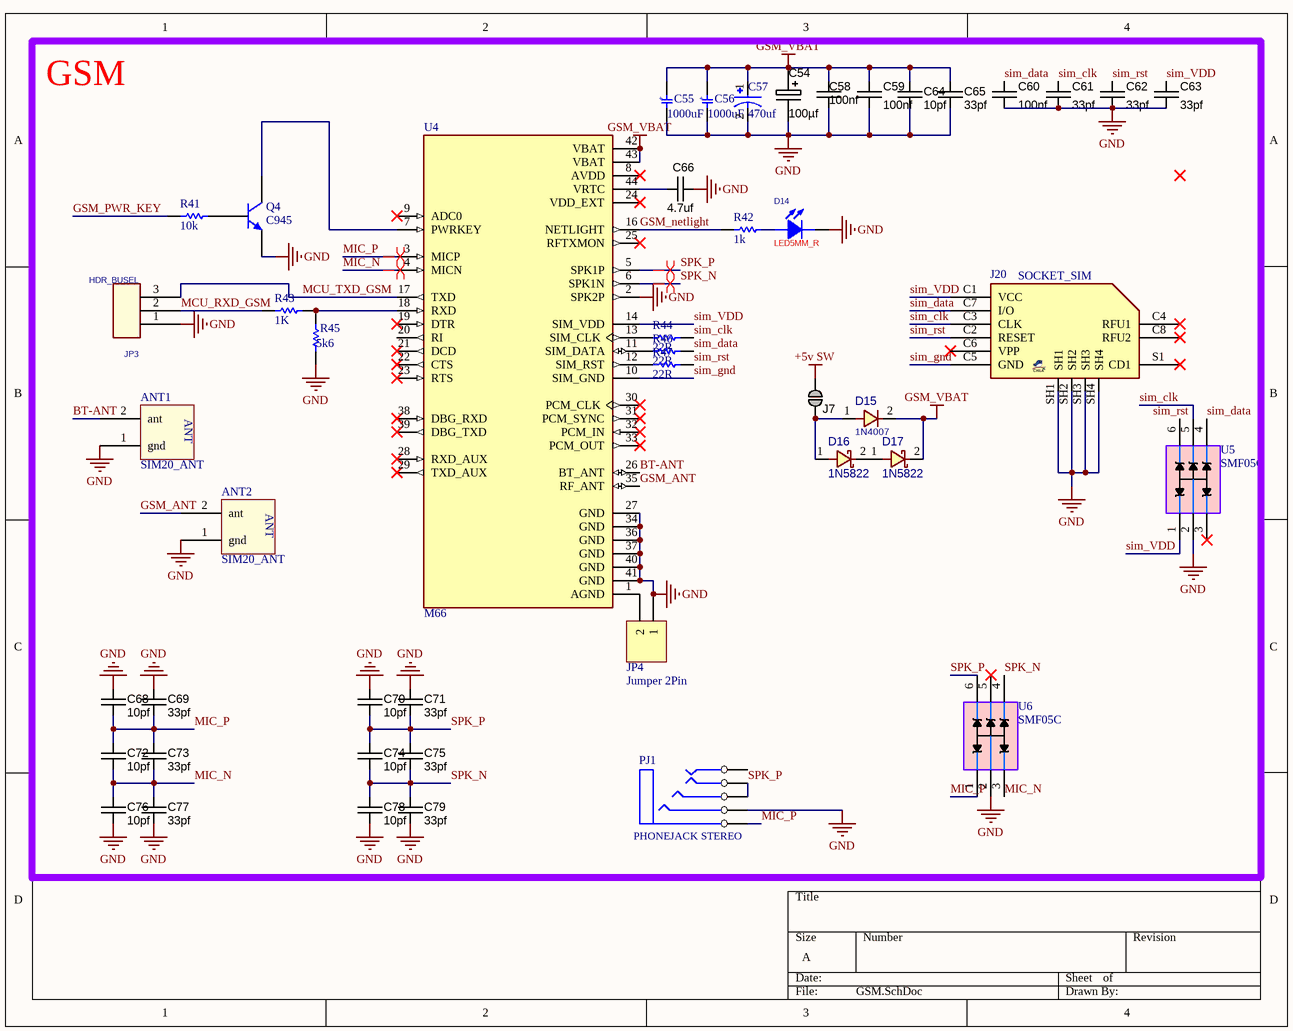
[diagram p3: GSM.SchDoc]

### Parts
ANT1  SIM20_ANT  [MY_SIM20_ANT]
ANT2  SIM20_ANT  [MY_SIM20_ANT]
C54  value 100µf  [CAPMP3528X210N]  (hidden comment: 100uf)
C55  1000uF  [Elko G]
C56  1000uF  [Elko G]
C57  470uf  [CAP_4TPB330ML]
C58  100nf  [CAPC1608X90N]
C59  100nf  [CAPC1608X90N]
C60  100nf  [CAPC1608X90N]
C61  33pf  [CAPC1608X90N]
C62  33pf  [CAPC1608X90N]
C63  33pf  [CAPC1608X90N]
C64  10pf  [CAPC1608X90N]
C65  33pf  [CAPC1608X90N]
C66  4.7uf  [CAPC1608X90N]
C68  10pf  [CAPC1608X90N]
C69  33pf  [CAPC1608X90N]
C70  10pf  [CAPC1608X90N]
C71  33pf  [CAPC1608X90N]
C72  10pf  [CAPC1608X90N]
C73  33pf  [CAPC1608X90N]
C74  10pf  [CAPC1608X90N]
C75  33pf  [CAPC1608X90N]
C76  10pf  [CAPC1608X90N]
C77  33pf  [CAPC1608X90N]
C78  10pf  [CAPC1608X90N]
C79  33pf  [CAPC1608X90N]
D14  LED5MM_R  [LED5MM_RED]
D15  1N4007  [D_SMA]
D16  1N5822  [D_SMA]
D17  1N5822  [D_SMA]
J7  Jumper  [JUMP1]  (value not drawn)  (no BOM)
J20  SOCKET_SIM  [SIM_MICRO_GCT]
JP3  HDR_BUSEL  [HDR_1x3]
JP4  Jumper 2Pin  [Jumper Small - 2.54 - Blue]
PJ1  PHONEJACK STEREO  [PHONE-J2-3.5MM]
Q4  C945  [SOT23_N]
R41  10k  [Resistor_SMD_0603 (1608)]
R42  1k  [Resistor_SMD_0603 (1608)]
R43  1K  [Resistor_SMD_0603 (1608)]
R44  22R  [Resistor_SMD_0603 (1608)]
R45  5k6  [Resistor_SMD_0603 (1608)]
R46  22R  [Resistor_SMD_0603 (1608)]
R47  22R  [Resistor_SMD_0603 (1608)]
U4  M66  [XCVR_M66]
U5  SMF05C  [SC706]
U6  SMF05C  [SC706]

### Nets
+5v SW: J7.1
GND: ANT1.1(gnd) ANT2.1(gnd) C54.2 C55.1 C56.1 C57.2 C58.1 C59.1 C60.1 C61.1 C62.1 C63.1 C64.1 C65.1 C66.2 C68.2 C69.2 C70.2 C71.2 C76.1 C77.1 C78.1 C79.1 D14.2(CATHODE) J20.SH1 J20.SH2 J20.SH3 J20.SH4 JP3.1 JP4.1 PJ1.GND Q4.2(E) R45.2 U4.2(SPK2P) U4.27(GND) U4.34(GND) U4.36(GND) U4.37(GND) U4.40(GND) U4.41(GND) U5.2(Gnd) U6.2(Gnd)
GSM_VBAT: C54.1 C55.2 C56.2 C57.1 C58.2 C59.2 C64.2 C65.2 D15.2 D17.2 U4.42(VBAT) U4.43(VBAT)
BT-ANT: ANT1.2(ant) U4.26(BT_ANT)
GSM_ANT: ANT2.2(ant) U4.35(RF_ANT)
GSM_netlight: R42.1 U4.16(NETLIGHT)
GSM_PWR_KEY: R41.1
MCU_RXD_GSM: JP3.2 R43.1
MCU_TXD_GSM: JP3.3 U4.17(TXD)
MIC_N: C72.1 C73.1 C76.2 C77.2 U4.4(MICN) U6.3(L3)
MIC_P: C68.1 C69.1 C72.2 C73.2 PJ1.MIC U4.3(MICP) U6.1(L1)
sim_clk: C61.2 J20.C3(CLK) R44.2 U5.5(L5)
sim_data: C60.2 J20.C7(I/O) R46.2 U5.4(L4)
sim_gnd: J20.C5(GND) U4.10(SIM_GND)
sim_rst: C62.2 J20.C2(RESET) R47.2
sim_VDD: C63.2 J20.C1(VCC) U4.14(SIM_VDD) U5.1(L1)
SPK_N: C74.1 C75.1 C78.2 C79.2 U4.6(SPK1N) U6.4(L4)
SPK_P: C70.1 C71.1 C74.2 C75.2 PJ1.EL PJ1.ER U4.5(SPK1P) U6.6(L6)
NetC66_1: C66.1 U4.44(VRTC)
NetD14_1: D14.1(ANODE) R42.2
NetD15_1: D15.1 D16.1 J7.2
NetD16_2: D16.2 D17.1
NetJP4_2: JP4.2 U4.1(AGND)
NetQ4_1: Q4.1(B) R41.2
NetQ4_3: Q4.3(C) U4.7(PWRKEY)
NetR43_2: R43.2 R45.1 U4.18(RXD)
NetR44_1: R44.1 U4.13(SIM_CLK)
NetR46_1: R46.1 U4.11(SIM_DATA)
NetR47_1: R47.1 U4.12(SIM_RST)

Not connected (* = marked no-connect by the designer): J20 C4(RFU1)* C6(VPP)* C8(RFU2)* S1(CD1)*; PJ1 PD(2); U4 8(AVDD)* 9(ADC0)* 19(DTR)* 20(RI) 21(DCD)* 22(CTS)* 23(RTS)* 24(VDD_EXT)* 25(RFTXMON)* 28(RXD_AUX)* 29(TXD_AUX)* 30(PCM_CLK)* 31(PCM_SYNC)* 32(PCM_IN)* 33(PCM_OUT)* 38(DBG_RXD)* 39(DBG_TXD)*; U5 3(L3)* 6(L6); U6 5(L5)*

### Layout directives
differential pair: MIC_N, MIC_P, SPK_N, SPK_P

### Notes on the sheet
- GSM
- Labels drawn without touching a wire or pin: sim_rst
- (in symbol Capacitor Electrical SMD) +

### Library data of the parts
ANT1 ANT2 = SIM20_ANT: ANT
C54 = CAPT_100u_1210_6V3: Capacitor SMD Tantalum 100uF 20% 6.3V 1210; Manufacturer 1: AVX Corporation; Manufacturer Part Number 1: TCJB107M006R0045; SCDType: spec; Package / Case: 1210 (3528 Metric); Tolerance: ±20%; Material: Tantalum; Supplier 1: Digi-Key; Supplier Part Number 1: 478-4711-1-ND
C55 C56 = Capacitor Electrical SMD: DatasheetVersion: 2021; ComponentLink1Description: Website Smart World; ComponentLink1URL: https://www.smartw.ir/; ComponentLink2Description: Telegram; ComponentLink2URL: https://t.me/altium_smartw; ComponentLink3Description: Instagram; ComponentLink3URL: https://Instagram.com/smartgw.ir
C57 = 4TPB330ML: CAP, 330ÂµF, 4V, 20%, 2917, SMD; Capacitance:330ÂµF; Voltage Rating:4V; Product Range:-; Capacitance Tolerance:Â± 20%; Manufacturer Size Code:D; ESR:0.04ohm; Operating Temperature Min:-55Â°C; Operating Temperature Max:105Â°C; Automotive Qualification Standard:-; Capacitance Tolerance Â±:Â± 20%; Capacitor Case Style:2917 [7343 Metric]; Capacitor Mounting:SMD; Capacitor Terminals:SMD; DC Ripple Current:2000mA; External Depth:2.8mm; External Length / Height:7.3mm; External Width:4.3mm; Leakage Current:132ÂµA; No. of Pins:2Pins; Operating Temperature Range:-55Â°C to +105Â°C; Reel Quantity:2500; Tantalum Capacitor Case:2917 [7343 Metric]; Tape Width:12mm; Tolerance +:20%; Tolerance -:20%; Voltage Rating V DC:4V; MF: Sanyo Electric; Availability: In Stock; Package: None; MP: 4TPB330ML; Value: *; Price: None; SnapEDA_Link: https://www.snapeda.com/parts/4TPB330ML/Sanyo/view-part/?ref=snap; Check_prices: https://www.snapeda.com/parts/4TPB330ML/Sanyo/view-part/?ref=eda
C58-C66 C68-C79 = CAPC_100n_0603_X7R_50V_10%: as C20 on sheet Power; Manufacturer 2: TDK Corporation; Manufacturer Part Number 2: C1608X7R1H104K; Package / Case: 0603 (1608 Metric); Tolerance: ±10%; Supplier 1: Digi-Key; Supplier Part Number 1: 478-5052-1-ND; ComponentLink1URL: http://www.avx.com/docs/Catalogs/cx7r.pdf; ComponentLink1Description: http://www.avx.com/docs/Catalogs/cx7r.pdf; Supplier 2: Digi-Key; Supplier Part Number 2: 445-1314-1-ND; ComponentLink2URL: http://product.tdk.com/capacitor/mlcc/en/documents/mlcc_commercial_general_en.pdf; ComponentLink2Description: http://product.tdk.com/capacitor/mlcc/en/documents/mlcc_commercial_general_en.pdf
D14 = LED5MM: LED LIGHTING; Designer: Abbas Basereh; Data: 16-12-2016; Link: *; Part.No: *
D15 = DIODE_SMD_1N4007: DIODE, GENERAL PURPOSE, 1000V/1A; MANF: Kingtronics; DESC: DESCRIPTION; PARAM: 1000V VRRM; PARAM2: 1A; MANF_P#: M7; ASSEMBLY: ASSEMBLY; PRICE: PRICE; VALUE: 1N4007
D16 D17 = DIODE_SMD_SCHOTTKY_1N5822: DIODE, SCHOTTKY, 40V, 3A; MANF: DIODES; DESC: DESCRIPTION; MANF_P#: 1N5822; ASSEMBLY: ASSEMBLY; PRICE: PRICE; PARAM2: 3A; PARAM: 40V; VALUE: 1N5822
J7 = JUMP1: SMD jumper
J20 = SIM_MICRO_GCT: SOCKET, SIM MICRO, PUSH/PUSH, SIM7100; MANF: GCT; DESC: MUP-C792; PRICE: 1.4$; MANF_P#: SIM7100; VALUE: SOCKET_SIM
JP3 = Header 1x3: header or jumper box
JP4 = Jumper 2Pin: Jumper, 2-Pin; Designer: Abbas Basereh; Data: 16-12-2016; Link: *
PJ1 = PHONEJACK STEREO SW
Q4 = C945: NPN Silicon Epitaxial Planar Transistor; Published: 2017-2-8; LatestRevisionDate: 2017; LatestRevisionNote: IPC-7351 Footprint Added.; DatasheetVersion: 2017; PackageVersion: 2017-2-8; PackageReference: SOT23; Publisher: Abbas Basereh; PackageDescription: 3-Pin SOT-23 Package 0.95 mm Pitch, 2.3 mm Lead Span; ComponentLink1Description: Manufacturer Link; ComponentLink1URL: http://www.taitroncomponents.com/; ComponentLink2Description: Datasheet; ComponentLink2URL: http://www.taitroncomponents.com/
R41 = Resistor: as R15 on sheet Power; Published: 17-Jun-2016; LatestRevisionNote: Re-released for puplic; Publisher: Seyed Razi Vesali; Value: 10k
R42-R47 = Resistor: as R7 on sheet Power; Published: 17-Jun-2016; LatestRevisionNote: Re-released for puplic; Publisher: Seyed Razi Vesali
U4 = M66: M66 is an ultra-small quad-band GSM/GPRS module using LCC castellation packaging on the market. Based on the latest 2G chipset, it has the optimal performance in SMS & Data transmission and audio service even in harsh environment.; MF: Quectel; Availability: In Stock; Value: *; Price: None; Check_prices: https://www.snapeda.com/parts/M66/Quectel/view-part/?ref=eda; SnapEDA_Link: https://www.snapeda.com/parts/M66/Quectel/view-part/?ref=snap; MP: M66; Package: SMD-52 Quectel
U5 U6 = TVS Diode: TVS Diode Array  For ESD and Latch-Up Protection

## Sheet RF & wireless.SchDoc
size A; SheetNumber: 5; SheetTotal: 10
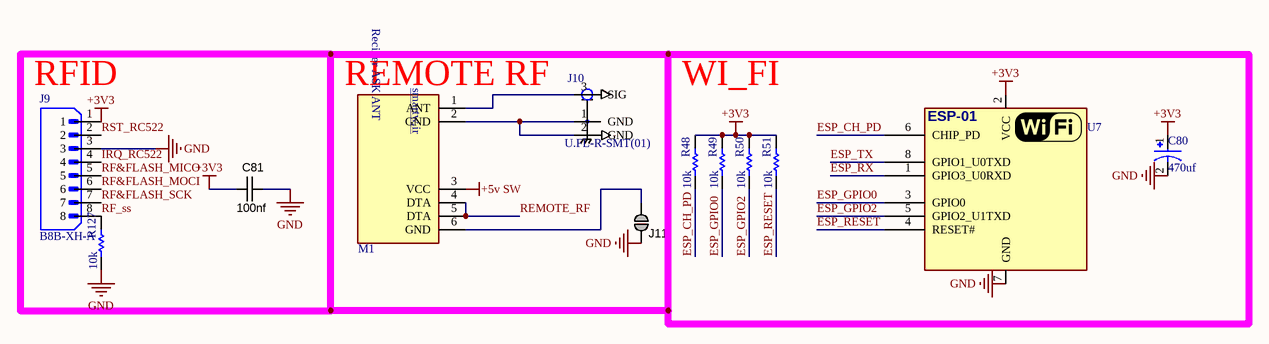
[diagram p4: RF & wireless.SchDoc]

### Parts
C80  470uf  [CAP_4TPB330ML]
C81  100nf  [CAPC1608X90N]
J9  B8B-XH-A  [JST_B8B-XH-A]
J10  U.FL-R-SMT(01)  [UFL]
J11  Jumper  [JUMP1]  (value not drawn)  (no BOM)
M1  ASK RF ANT 315/433MHZ  [RF_ETRXB]  (value not drawn)
R48  10k  [Resistor_SMD_0603 (1608)]
R49  10k  [Resistor_SMD_0603 (1608)]
R50  10k  [Resistor_SMD_0603 (1608)]
R51  10k  [Resistor_SMD_0603 (1608)]
R127  10k  [Resistor_SMD_0603 (1608)]
U7  ESP-01  [ESP8266_ESP01]  (value not drawn)

### Nets
+3V3: C80.1 C81.1 J9.1 R48.1 R49.1 R50.1 R51.1 U7.2(VCC)
+5v SW: M1.3(VCC)
GND: C80.2 C81.2 J9.3 J11.2 R127.2 U7.7(GND)
ESP_CH_PD: R48.2 U7.6(CHIP_PD)
ESP_GPIO0: R49.2 U7.3(GPIO0)
ESP_GPIO2: R50.2 U7.5(GPIO2_U1TXD)
ESP_RESET: R51.2 U7.4(RESET#)
ESP_RX: U7.1(GPIO3_U0RXD)
ESP_TX: U7.8(GPIO1_U0TXD)
IRQ_RC522: J9.4
REMOTE_RF: M1.4(DTA) M1.5(DTA)
RF&FLASH_MICO: J9.5
RF&FLASH_MOCI: J9.6
RF&FLASH_SCK: J9.7
RF_ss: J9.8 R127.1
RST_RC522: J9.2
NetJ10_1: J10.1(GND) J10.2(GND) M1.2(GND)
NetJ10_3: J10.3(SIG) M1.1(ANT)
NetJ11_1: J11.1 M1.6(GND)

### Notes on the sheet
- (near J9) RFID
- (near M1) REMOTE RF
- WI_FI
- (in symbol ASK RF ANT 315/433MHZ) Reciver ASK ANT; smartw.ir

### Library data of the parts
C80 = 4TPB330ML: as C57 on sheet GSM; Availability: In Stock; Package: None; MP: 4TPB330ML; Value: *; Price: None; SnapEDA_Link: https://www.snapeda.com/parts/4TPB330ML/Sanyo/view-part/?ref=snap; Check_prices: https://www.snapeda.com/parts/4TPB330ML/Sanyo/view-part/?ref=eda
C81 = CAPC_100n_0603_X7R_50V_10%: as C20 on sheet Power; Manufacturer 2: TDK Corporation; Manufacturer Part Number 2: C1608X7R1H104K; Package / Case: 0603 (1608 Metric); Tolerance: ±10%; Supplier 1: Digi-Key; Supplier Part Number 1: 478-5052-1-ND; ComponentLink1URL: http://www.avx.com/docs/Catalogs/cx7r.pdf; ComponentLink1Description: http://www.avx.com/docs/Catalogs/cx7r.pdf; Supplier 2: Digi-Key; Supplier Part Number 2: 445-1314-1-ND; ComponentLink2URL: http://product.tdk.com/capacitor/mlcc/en/documents/mlcc_commercial_general_en.pdf; ComponentLink2Description: http://product.tdk.com/capacitor/mlcc/en/documents/mlcc_commercial_general_en.pdf
J9 = B8B-XH-A: Connector Header Through Hole 8 position 0.098 (2.50mm); MF: JST; SnapEDA_Link: https://www.snapeda.com/parts/B8B-XH-A/JST/view-part/?ref=snap; Package: None; Value: *; MP: B8B-XH-A; Check_prices: https://www.snapeda.com/parts/B8B-XH-A/JST/view-part/?ref=eda
J10 = U.FL-R-SMT(01): U.FL Series 6 Ghz 50 Ohm Ultra-small SMT Coaxial Cable Receptacle; MF: Hirose; MP: U.FL-R-SMT(01); Price: 0.87 USD; Package: None; Availability: Good; Value: *
J11 = JUMP1: SMD jumper
R48-R51 = Resistor: as R15 on sheet Power; Published: 17-Jun-2016; LatestRevisionNote: Re-released for puplic; Publisher: Seyed Razi Vesali; Value: 10k
R127 = Resistor: Email: razi.vesali@gmail.com; Published: 17-Jun-2016; LatestRevisionNote: Re-released for puplic; Publisher: Seyed Razi Vesali; Value: 10k
U7 = ESP8266_ESP-01: ESP8266 ESP-01 WiFi Module; MANF_P#: ESP-01; VALUE: ESP-01
M1 = ASK RF ANT 315/433MHZ: ComponentLink1Description: Website Smart World; ComponentLink1URL: https://www.smartw.ir/; ComponentLink2Description: Telegram; ComponentLink2URL: https://t.me/altium_smartw; ComponentLink3Description: Instagram; ComponentLink3URL: https://Instagram.com/smartgw.ir; DatasheetVersion: 2021

## Sheet LAN.SchDoc
size A; SheetNumber: 6; SheetTotal: 10
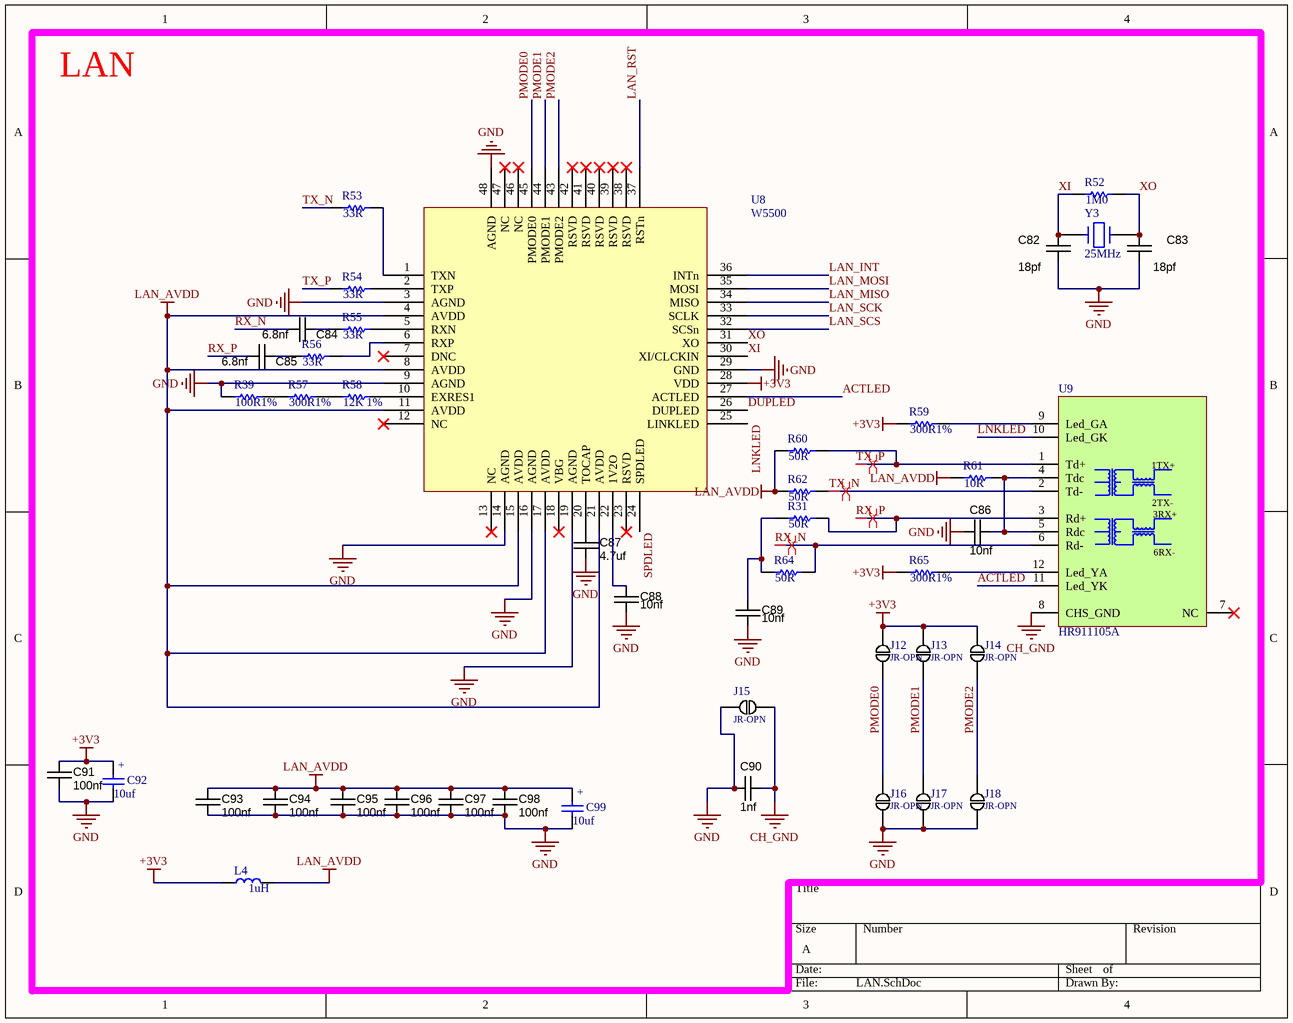
[diagram p5: LAN.SchDoc]

### Parts
C82  18pf  [CAPC1608X90N]
C83  18pf  [CAPC1608X90N]
C84  6.8nf  [CAPC1608X90N]
C85  6.8nf  [CAPC1608X90N]
C86  10nf  [CAPC1608X90N]
C87  4.7uf  [CAPC1608X90N]
C88  10nf  [CAPC1608X90N]
C89  10nf  [CAPC1608X90N]
C90  1nf  [CAPC1608X90N]
C91  100nf  [CAPC1608X90N]
C92  10uf  [MY_CAP_SMD-A]
C93  100nf  [CAPC1608X90N]
C94  100nf  [CAPC1608X90N]
C95  100nf  [CAPC1608X90N]
C96  100nf  [CAPC1608X90N]
C97  100nf  [CAPC1608X90N]
C98  100nf  [CAPC1608X90N]
C99  10uf  [MY_CAP_SMD-A]
J12  JR-OPN  [0603-J]
J13  JR-OPN  [0603-J]
J14  JR-OPN  [0603-J]
J15  JR-OPN  [0603-J]
J16  JR-OPN  [0603-J]
J17  JR-OPN  [0603-J]
J18  JR-OPN  [0603-J]
L4  1uH  [L0805]
R31  50R  [Resistor_SMD_0603 (1608)]
R39  100R1%  [Resistor_SMD_0603 (1608)]
R52  1M0  [Resistor_SMD_0603 (1608)]
R53  33R  [Resistor_SMD_0603 (1608)]
R54  33R  [Resistor_SMD_0603 (1608)]
R55  33R  [Resistor_SMD_0603 (1608)]
R56  33R  [Resistor_SMD_0603 (1608)]
R57  300R1%  [Resistor_SMD_0603 (1608)]
R58  12K 1%  [Resistor_SMD_0603 (1608)]
R59  300R1%  [Resistor_SMD_0603 (1608)]
R60  50R  [Resistor_SMD_0603 (1608)]
R61  10R  [Resistor_SMD_0603 (1608)]
R62  50R  [Resistor_SMD_0603 (1608)]
R64  50R  [Resistor_SMD_0603 (1608)]
R65  300R1%  [Resistor_SMD_0603 (1608)]
U8  W5500  [LQFP48]
U9  HR911105A  [HR911105A]
Y3  25MHz  [My_Crystal - SMD]

### Nets
+3V3: C91.2 C92.+ J12.1 J13.1 J14.1 L4.1 R59.1 R65.1 U8.28(VDD)
CH_GND: C90.2 J15.1 U9.8(CHS_GND)
GND: C82.1 C83.1 C86.1 C87.1 C88.1 C89.1 C90.1 C91.1 C92.- C93.1 C94.1 C95.1 C96.1 C97.1 C98.1 C99.- J15.2 J16.2 J17.2 J18.2 R39.1 U8.3(AGND) U8.9(AGND) U8.14(AGND) U8.16(AGND) U8.19(AGND) U8.29(GND) U8.48(AGND)
LAN_AVDD: C93.2 C94.2 C95.2 C96.2 C97.2 C98.2 C99.+ L4.2 R60.1 R61.1 R62.1 U8.4(AVDD) U8.8(AVDD) U8.11(AVDD) U8.15(AVDD) U8.17(AVDD) U8.21(AVDD)
ACTLED: U8.27(ACTLED) U9.11(Led_YK)
DUPLED: U8.26(DUPLED)
LAN_INT: U8.36(INTn)
LAN_MISO: U8.34(MISO)
LAN_MOSI: U8.35(MOSI)
LAN_RST: U8.37(RSTn)
LAN_SCK: U8.33(SCLK)
LAN_SCS: U8.32(SCSn)
LNKLED: U8.25(LINKLED) U9.10(Led_GK)
PMODE0: J12.2 J16.1 U8.45(PMODE0)
PMODE1: J13.2 J17.1 U8.44(PMODE1)
PMODE2: J14.2 J18.1 U8.43(PMODE2)
RX_N: C84.2 R64.2 U9.6(Rd-)
RX_P: C85.2 R31.2 U9.3(Rd+)
SPDLED: U8.24(SPDLED)
TX_N: R53.1 R62.2 U9.2(Td-)
TX_P: R54.1 R60.2 U9.1(Td+)
XI: C82.2 R52.1 U8.30(XI/CLCKIN) Y3.1
XO: C83.2 R52.2 U8.31(XO) Y3.2
NetC84_1: C84.1 R55.1
NetC85_1: C85.1 R56.1
NetC86_2: C86.2 R61.2 U9.4(Tdc) U9.5(Rdc)
NetC87_2: C87.2 U8.20(TOCAP)
NetC88_2: C88.2 U8.22(1V2O)
NetC89_2: C89.2 R31.1 R64.1
NetR39_2: R39.2 R57.1
NetR53_2: R53.2 U8.1(TXN)
NetR54_2: R54.2 U8.2(TXP)
NetR55_2: R55.2 U8.5(RXN)
NetR56_2: R56.2 U8.6(RXP)
NetR57_2: R57.2 R58.1
NetR58_2: R58.2 U8.10(EXRES1)
NetR59_2: R59.2 U9.9(Led_GA)
NetR65_2: R65.2 U9.12(Led_YA)

Not connected (* = marked no-connect by the designer): U8 7(DNC)* 12(NC)* 13(NC)* 18(VBG)* 23(RSVD)* 38(RSVD)* 39(RSVD)* 40(RSVD)* 41(RSVD)* 42(RSVD)* 46(NC)* 47(NC)*; U9 7(NC)*

### Layout directives
differential pair: RX_N, RX_P, TX_N, TX_P

### Notes on the sheet
- LAN
- (in symbol HR911105A) 1TX+; 2TX-; 3RX+ /; 6RX- /

### Library data of the parts
C82-C91 C93-C98 = CAPC_100n_0603_X7R_50V_10%: as C20 on sheet Power; Manufacturer 2: TDK Corporation; Manufacturer Part Number 2: C1608X7R1H104K; Package / Case: 0603 (1608 Metric); Tolerance: ±10%; Supplier 1: Digi-Key; Supplier Part Number 1: 478-5052-1-ND; ComponentLink1URL: http://www.avx.com/docs/Catalogs/cx7r.pdf; ComponentLink1Description: http://www.avx.com/docs/Catalogs/cx7r.pdf; Supplier 2: Digi-Key; Supplier Part Number 2: 445-1314-1-ND; ComponentLink2URL: http://product.tdk.com/capacitor/mlcc/en/documents/mlcc_commercial_general_en.pdf; ComponentLink2Description: http://product.tdk.com/capacitor/mlcc/en/documents/mlcc_commercial_general_en.pdf
C92 C99 = CAP_TANTAL_A: 3.2X1.6MM; Value: 3300u
J12-J18 = BYPASS: as J4 on sheet Power; Supplier 1: Solder-it-yourself; Manufacturer 1: Board feature
L4 = Inductor SMD NC 0805: DatasheetVersion: 2022; ComponentLink1Description: Tarahiboard; ComponentLink1URL: https://www.tarahiboard.com/product/library-pack; Value: 1uH
R31 R39 R52-R62 R64 R65 = Resistor: as R7 on sheet Power; Published: 17-Jun-2016; LatestRevisionNote: Re-released for puplic; Publisher: Seyed Razi Vesali
U8 = W5500: Ethernet Controller, 10/100, SPI, DMA
U9 = HR911105A: RJ45, 10/100BASE, G/Y LED
Y3 = CRYSTAL_SMD: Crystal

## Sheet sensors.SchDoc
size A; SheetNumber: 7; SheetTotal: 10
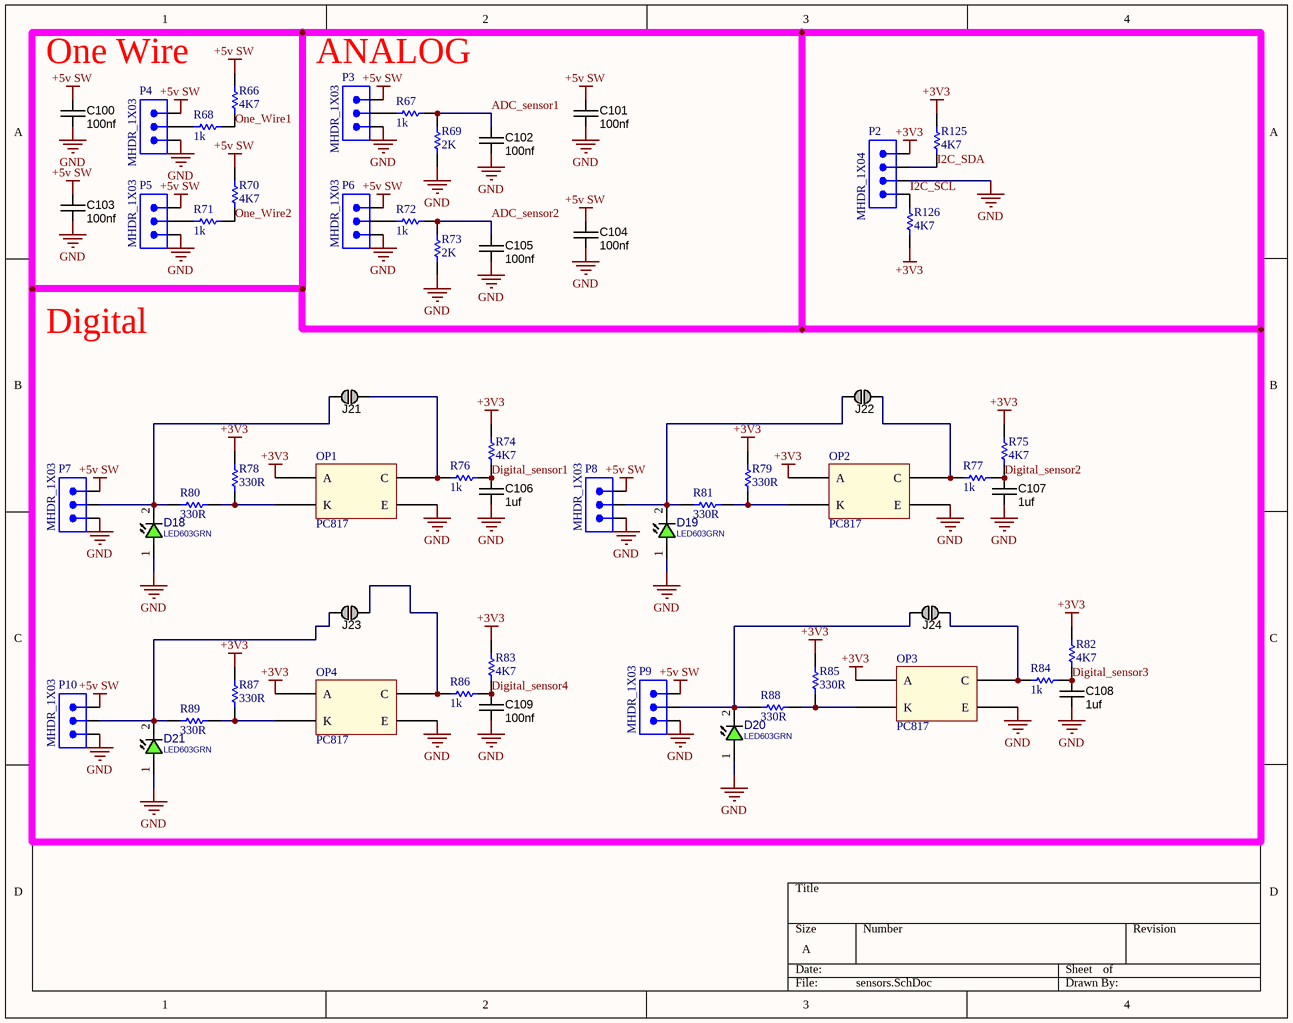
[diagram p6: sensors.SchDoc]

### Parts
C100  100nf  [CAPC1608X90N]
C101  100nf  [CAPC1608X90N]
C102  100nf  [CAPC1608X90N]
C103  100nf  [CAPC1608X90N]
C104  100nf  [CAPC1608X90N]
C105  100nf  [CAPC1608X90N]
C106  1uf  [CAPC1608X90N]
C107  1uf  [CAPC1608X90N]
C108  1uf  [CAPC1608X90N]
C109  100nf  [CAPC1608X90N]
D18  LED603GRN  [LED0603GRN]
D19  LED603GRN  [LED0603GRN]
D20  LED603GRN  [LED0603GRN]
D21  LED603GRN  [LED0603GRN]
J21  Jumper  [JUMP1]  (value not drawn)  (no BOM)
J22  Jumper  [JUMP1]  (value not drawn)  (no BOM)
J23  Jumper  [JUMP1]  (value not drawn)  (no BOM)
J24  Jumper  [JUMP1]  (value not drawn)  (no BOM)
OP1  PC817  [PC817 SMD]
OP2  PC817  [PC817 SMD]
OP3  PC817  [PC817 SMD]
OP4  PC817  [PC817 SMD]
P2  MHDR_1X04  [MHDR1X04-254P]
P3  MHDR_1X03  [MHDR1X03-254P]
P4  MHDR_1X03  [MHDR1X03-254P]
P5  MHDR_1X03  [MHDR1X03-254P]
P6  MHDR_1X03  [MHDR1X03-254P]
P7  MHDR_1X03  [MHDR1X03-254P]
P8  MHDR_1X03  [MHDR1X03-254P]
P9  MHDR_1X03  [MHDR1X03-254P]
P10  MHDR_1X03  [MHDR1X03-254P]
R66  4K7  [Resistor_SMD_0603 (1608)]
R67  1k  [Resistor_SMD_0603 (1608)]
R68  1k  [Resistor_SMD_0603 (1608)]
R69  2K  [Resistor_SMD_0603 (1608)]
R70  4K7  [Resistor_SMD_0603 (1608)]
R71  1k  [Resistor_SMD_0603 (1608)]
R72  1k  [Resistor_SMD_0603 (1608)]
R73  2K  [Resistor_SMD_0603 (1608)]
R74  4K7  [Resistor_SMD_0603 (1608)]
R75  4K7  [Resistor_SMD_0603 (1608)]
R76  1k  [Resistor_SMD_0603 (1608)]
R77  1k  [Resistor_SMD_0603 (1608)]
R78  330R  [Resistor_SMD_0603 (1608)]
R79  330R  [Resistor_SMD_0603 (1608)]
R80  330R  [Resistor_SMD_0603 (1608)]
R81  330R  [Resistor_SMD_0603 (1608)]
R82  4K7  [Resistor_SMD_0603 (1608)]
R83  4K7  [Resistor_SMD_0603 (1608)]
R84  1k  [Resistor_SMD_0603 (1608)]
R85  330R  [Resistor_SMD_0603 (1608)]
R86  1k  [Resistor_SMD_0603 (1608)]
R87  330R  [Resistor_SMD_0603 (1608)]
R88  330R  [Resistor_SMD_0603 (1608)]
R89  330R  [Resistor_SMD_0603 (1608)]
R125  4K7  [Resistor_SMD_0603 (1608)]
R126  4K7  [Resistor_SMD_0603 (1608)]

### Nets
+3V3: OP1.1(A) OP2.1(A) OP3.1(A) OP4.1(A) P2.4 R74.1 R75.1 R78.1 R79.1 R82.1 R83.1 R85.1 R87.1 R125.2 R126.2
+5v SW: C100.1 C101.1 C103.1 C104.1 P3.3 P4.3 P5.3 P6.3 P7.3 P8.3 P9.3 P10.3 R66.1 R70.1
GND: C100.2 C101.2 C102.2 C103.2 C104.2 C105.2 C106.2 C107.2 C108.2 C109.2 D18.1(ANODE) D19.1(ANODE) D20.1(ANODE) D21.1(ANODE) OP1.3(E) OP2.3(E) OP3.3(E) OP4.3(E) P2.2 P3.1 P4.1 P5.1 P6.1 P7.1 P8.1 P9.1 P10.1 R69.1 R73.1
ADC_sensor1: C102.1 R67.1 R69.2
ADC_sensor2: C105.1 R72.1 R73.2
Digital_sensor1: C106.1 R74.2 R76.1
Digital_sensor2: C107.1 R75.2 R77.1
Digital_sensor3: C108.1 R82.2 R84.1
Digital_sensor4: C109.1 R83.2 R86.1
I2C_SCL: P2.1 R126.1
I2C_SDA: P2.3 R125.1
One_Wire1: R66.2 R68.1
One_Wire2: R70.2 R71.1
NetD18_2: D18.2(CATHODE) J21.1 P7.2 R80.2
NetD19_2: D19.2(CATHODE) J22.1 P8.2 R81.2
NetD20_2: D20.2(CATHODE) J24.1 P9.2 R88.2
NetD21_2: D21.2(CATHODE) J23.1 P10.2 R89.2
NetJ21_2: J21.2 OP1.4(C) R76.2
NetJ22_2: J22.2 OP2.4(C) R77.2
NetJ23_2: J23.2 OP4.4(C) R86.2
NetJ24_2: J24.2 OP3.4(C) R84.2
NetOP1_2: OP1.2(K) R78.2 R80.1
NetOP2_2: OP2.2(K) R79.2 R81.1
NetOP3_2: OP3.2(K) R85.2 R88.1
NetOP4_2: OP4.2(K) R87.2 R89.1
NetP3_2: P3.2 R67.2
NetP4_2: P4.2 R68.2
NetP5_2: P5.2 R71.2
NetP6_2: P6.2 R72.2

### Notes on the sheet
- One Wire
- ANALOG
- Digital

### Library data of the parts
C100-C109 = CAPC_100n_0603_X7R_50V_10%: as C20 on sheet Power; Manufacturer 2: TDK Corporation; Manufacturer Part Number 2: C1608X7R1H104K; Package / Case: 0603 (1608 Metric); Tolerance: ±10%; Supplier 1: Digi-Key; Supplier Part Number 1: 478-5052-1-ND; ComponentLink1URL: http://www.avx.com/docs/Catalogs/cx7r.pdf; ComponentLink1Description: http://www.avx.com/docs/Catalogs/cx7r.pdf; Supplier 2: Digi-Key; Supplier Part Number 2: 445-1314-1-ND; ComponentLink2URL: http://product.tdk.com/capacitor/mlcc/en/documents/mlcc_commercial_general_en.pdf; ComponentLink2Description: http://product.tdk.com/capacitor/mlcc/en/documents/mlcc_commercial_general_en.pdf
D18-D21 = LED_SMD_0603_GRN: as D26 on sheet Power; ASSEMBLY: ASSEMBLY; PRICE: 1: 0.14$, 100: 6.8$; VALUE: LED603GRN
J21-J24 = JUMP1: SMD jumper
OP1-OP4 = PC817: PC817 optocpler; ComponentLink2Description: Website Smart World; ComponentLink2URL: https://www.smartw.ir/; ComponentLink3Description: Telegram; ComponentLink3URL: https://t.me/altium_smartw; ComponentLink4Description: Instagram; ComponentLink4URL: https://Instagram.com/smartgw.ir; DatasheetVersion: 2021
P2 = MHDR_1X04: Male Header 1X04
P3-P10 = MHDR_1X03: Male Header 1X03
R66-R89 R125 R126 = Resistor: as R7 on sheet Power; Published: 17-Jun-2016; LatestRevisionNote: Re-released for puplic; Publisher: Seyed Razi Vesali